# EAGLE design atmega328_programmer V2 (EAGLE 9.6.2)
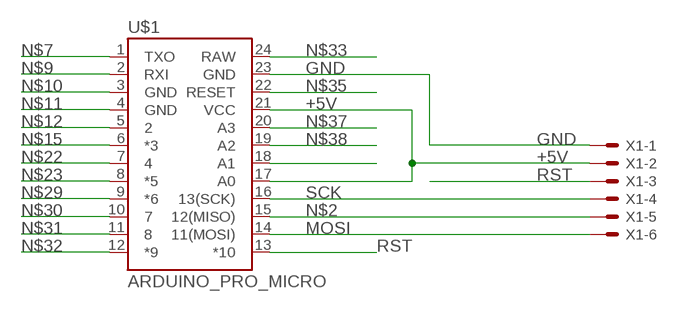
[diagram p0: schematic, sheet 1]

## Parts
U$1  ARDUINO_PRO_MICRO  [ARDUINO_PRO_MICRO]
X1  22-23-2061  [22-23-2061]

## Nets
+5V: U$1.17(A0) U$1.21(VCC) X1.2
GND: U$1.23(GND) X1.1
MOSI: U$1.14(11(MOSI)) X1.6
N$1: U$1.18(A1)
N$2: U$1.15(12(MISO)) X1.5
N$7: U$1.1(TXO)
N$9: U$1.2(RXI)
N$10: U$1.3(GND)
N$11: U$1.4(GND)
N$12: U$1.5
N$15: U$1.6(*3)
N$22: U$1.7
N$23: U$1.8(*5)
N$29: U$1.9(*6)
N$30: U$1.10
N$31: U$1.11
N$32: U$1.12(*9)
N$33: U$1.24(RAW)
N$35: U$1.22(RESET)
N$37: U$1.20(A3)
N$38: U$1.19(A2)
RST: U$1.13(*10) X1.3
SCK: U$1.16(13(SCK)) X1.4

## Library data of the parts
U$1 = SparkFun-Boards:ARDUINO_PRO_MICRO
X1 = con-molex:22-23-2061: .100" (2.54mm) Center Header - 6 Pin; MF: MOLEX; MPN: 22-23-2061; OC_FARNELL: 1462922; OC_NEWARK: 27C1933

## Board
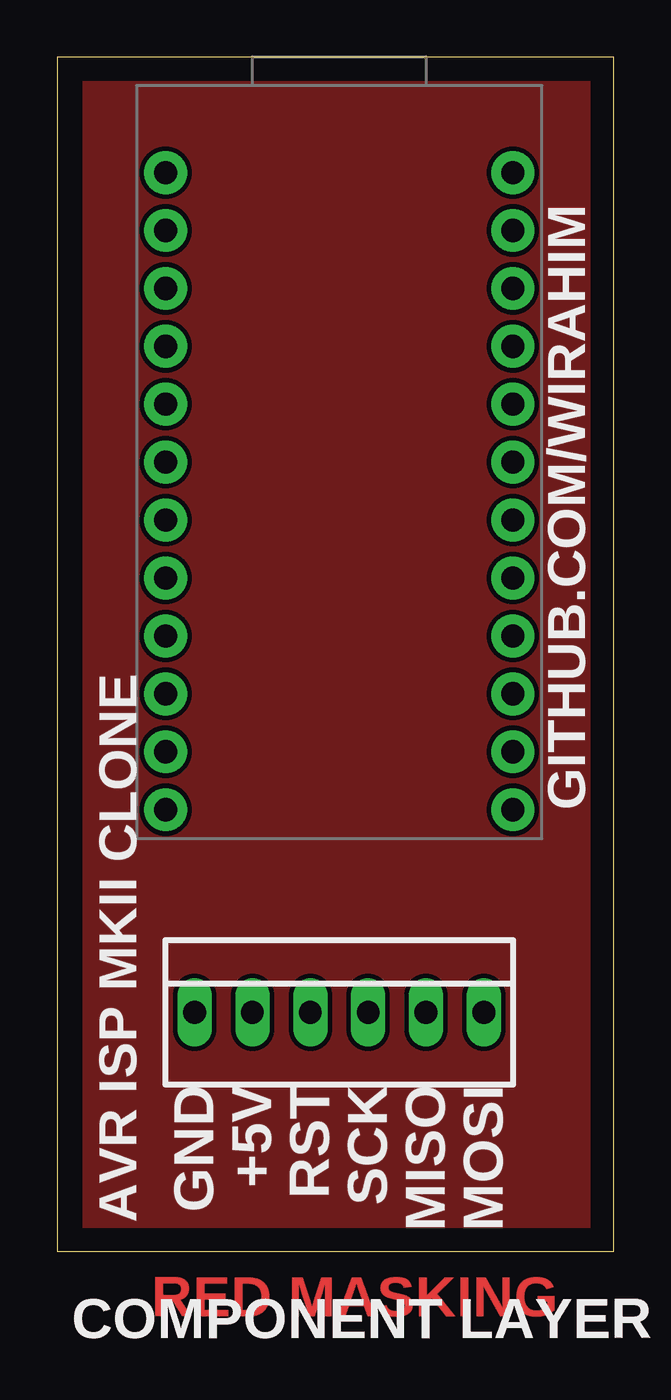
[diagram p1: board, top side]
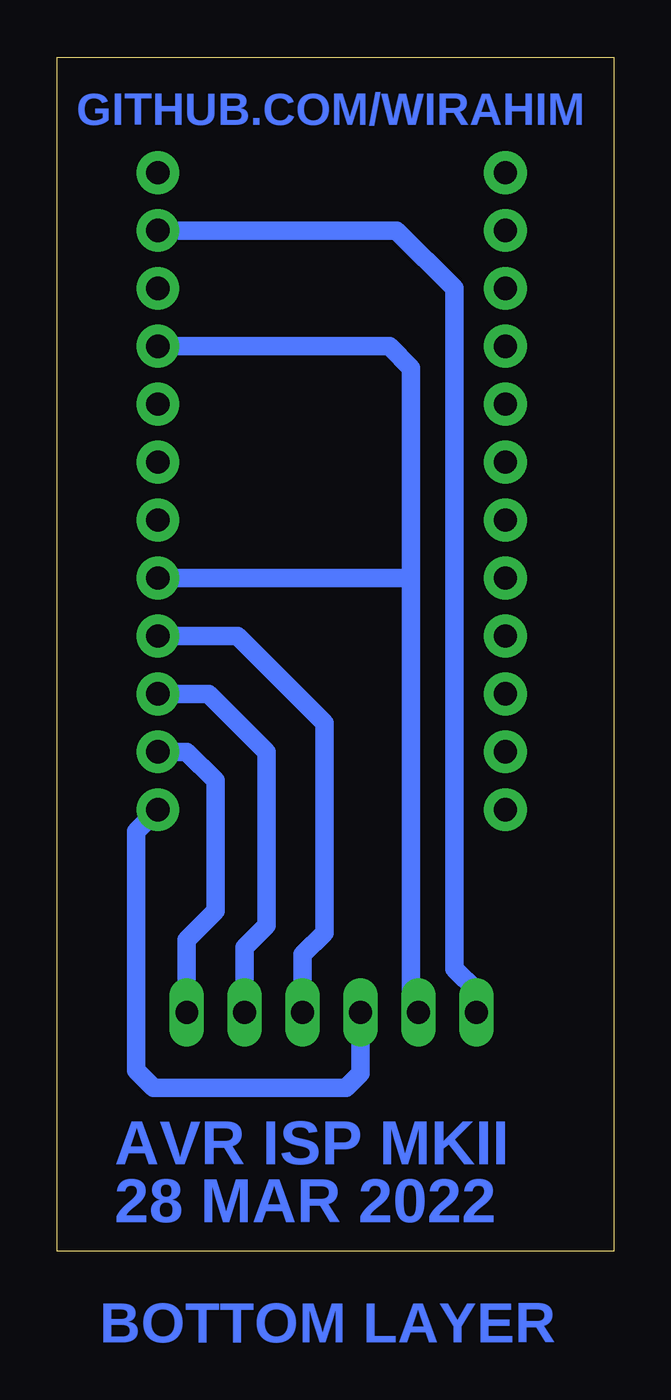
[diagram p2: board, bottom side, seen from below]

Size 24.43 x 52.38 mm. Coordinates in mm from the lower left corner, seen from the top.
Outline: 0,0 24.43,0 24.43,52.38 0,52.38 0,0
Copper layers (1*16): Top 0.035mm / dielectric 1.5mm / Bottom 0.035mm
Design rules "default": minimum track width 10mil, minimum drill 24mil, track to track 8mil, track to pad 8mil, pad to pad 8mil, via to via 8mil, smd to smd 8mil, copper to edge 40mil, drill to drill 8mil, minimum pad ring 10mil, minimum via ring 8mil, stop-mask expansion 4mil, vias tented up to drill 0mil, thermal gap 10mil

### Footprints (pad centres in the part's own frame; a part is rotated, then mirrored left to right if it is on the bottom)
ARDUINO_PRO_MICRO = drill 1.016 pad 1.88: 1 -7.62,12.7; 2 -7.62,10.16; 3 -7.62,7.62; 4 -7.62,5.08; 5 -7.62,2.54; 6 -7.62,0; 7 -7.62,-2.54; 8 -7.62,-5.08; 9 -7.62,-7.62; 10 -7.62,-10.16; 11 -7.62,-12.7; 12 -7.62,-15.24; 13 7.62,-15.24; 14 7.62,-12.7; 15 7.62,-10.16; 16 7.62,-7.62; 17 7.62,-5.08; 18 7.62,-2.54; 19 7.62,0; 20 7.62,2.54; 21 7.62,5.08; 22 7.62,7.62; 23 7.62,10.16; 24 7.62,12.7
22-23-2061 = drill 1 long: 1 -6.35,0; 2 -3.81,0; 3 -1.27,0; 4 1.27,0; 5 3.81,0; 6 6.35,0

### Placement (x,y rotation side)
U$1  12.38,34.61 0 top
X1  12.38,10.48 0 top

### Tracks (layer width: path | path; a pad name or v marks a point on that pad's centre or on a via)
+5V
  Bottom 0.813: X1.2 8.89,10.79 8.89,29.53 | U$1.21 9.84,39.69 8.89,38.73 8.89,29.53 | U$1.17 8.89,29.53
GND
  Bottom 0.813: X1.1 6.03,11.43 6.99,12.38 6.99,42.23 9.53,44.77 U$1.23
MOSI
  Bottom 0.813: X1.6 18.73,13.65 17.46,14.92 17.46,20.64 18.73,21.91 U$1.14
N$2
  Bottom 0.813: X1.5 16.19,13.34 15.24,14.29 15.24,21.91 17.78,24.45 U$1.15
N$3
  pour Top: 1.27,51.75 23.5,51.75 23.5,0.64 1.27,0.64
RST
  Bottom 0.813: X1.3 11.11,7.81 11.75,7.17 20.19,7.17 20.95,7.94 20.95,18.41 U$1.13
SCK
  Bottom 0.813: X1.4 13.65,13.02 12.7,13.97 12.7,23.18 16.51,26.99 U$1.16

### Text on the board
Top: RED MASKING
Bottom: GITHUB.COM/WIRAHIM | AVR ISP MKII | 28 MAR 2022 | BOTTOM LAYER
tPlace: GND | +5V | RST | SCK | MISO | MOSI | COMPONENT LAYER
tNames: GITHUB.COM/WIRAHIM | AVR ISP MKII CLONE